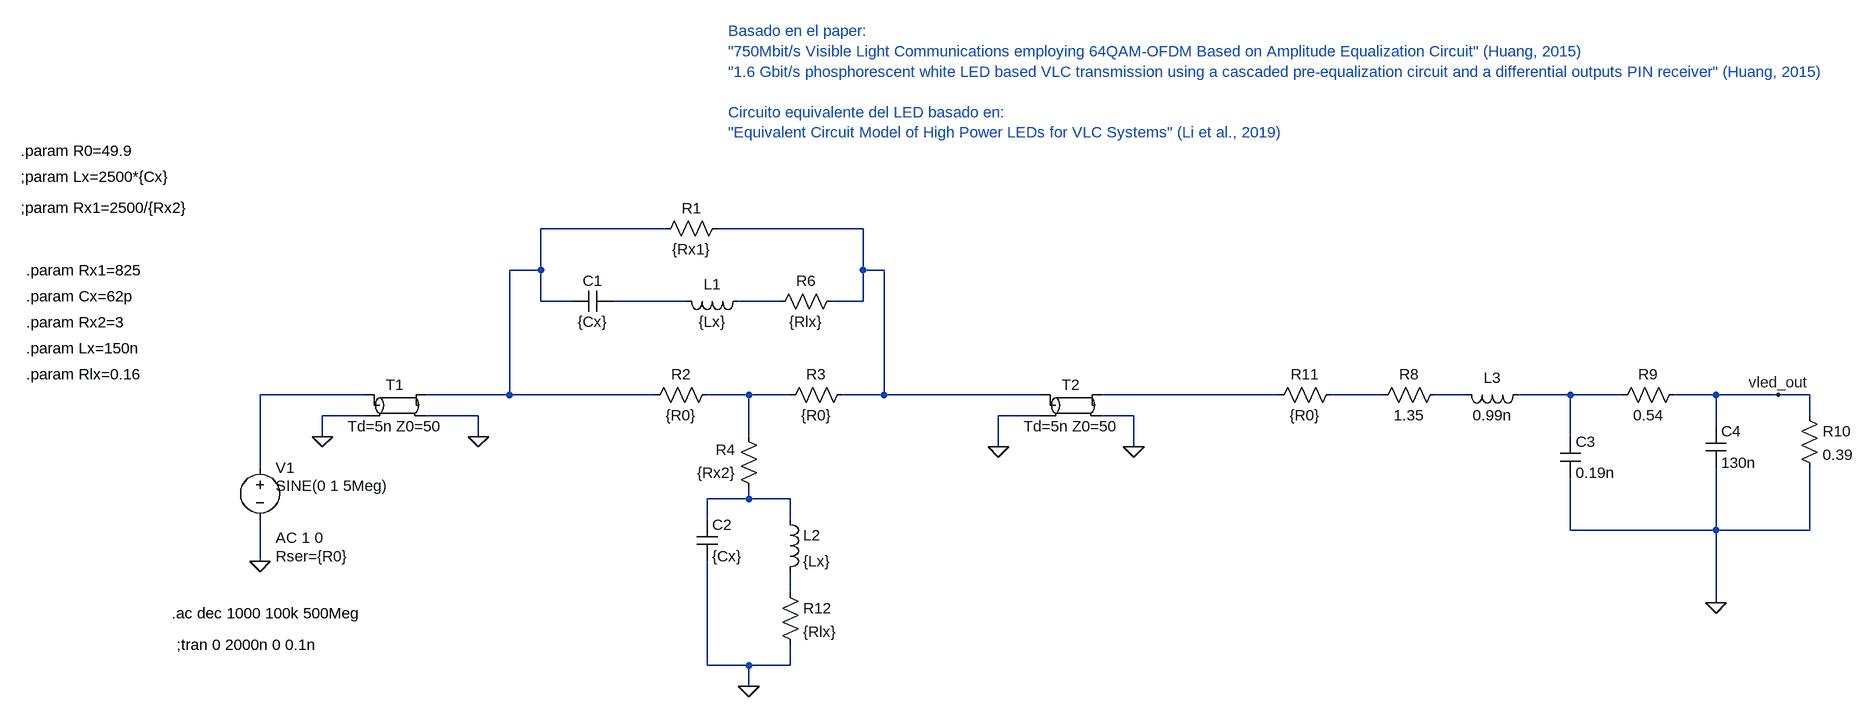
[diagram p0: schematic filtro_t.asc]
filtro_t.asc, the LTspice schematic file:
Version 4
SHEET 1 3516 848
WIRE -32 64 -224 64
WIRE 272 64 48 64
WIRE -224 128 -224 64
WIRE -224 128 -272 128
WIRE 272 128 272 64
WIRE 304 128 272 128
WIRE -224 176 -224 128
WIRE -176 176 -224 176
WIRE 0 176 -112 176
WIRE 144 176 80 176
WIRE 272 176 272 128
WIRE 272 176 224 176
WIRE -496 320 -656 320
WIRE -272 320 -272 128
WIRE -272 320 -400 320
WIRE -48 320 -272 320
WIRE 96 320 32 320
WIRE 160 320 96 320
WIRE 304 320 304 128
WIRE 304 320 240 320
WIRE 544 320 304 320
WIRE 912 320 640 320
WIRE 1072 320 992 320
WIRE 1200 320 1152 320
WIRE 1360 320 1280 320
WIRE 1440 320 1360 320
WIRE 1584 320 1520 320
WIRE 1680 320 1584 320
WIRE 1728 320 1680 320
WIRE -496 352 -560 352
WIRE -320 352 -400 352
WIRE 544 352 480 352
WIRE 688 352 640 352
WIRE 1728 352 1728 320
WIRE 1584 368 1584 320
WIRE -560 384 -560 352
WIRE -320 384 -320 352
WIRE 96 384 96 320
WIRE 1360 384 1360 320
WIRE 480 400 480 352
WIRE 688 400 688 352
WIRE -656 432 -656 320
WIRE 96 480 96 464
WIRE 96 480 32 480
WIRE 160 480 96 480
WIRE 32 512 32 480
WIRE 160 512 160 480
WIRE 1360 528 1360 448
WIRE 1584 528 1584 432
WIRE 1584 528 1360 528
WIRE 1728 528 1728 432
WIRE 1728 528 1584 528
WIRE -656 576 -656 512
WIRE 160 624 160 592
WIRE 1584 640 1584 528
WIRE 32 736 32 576
WIRE 96 736 32 736
WIRE 160 736 160 704
WIRE 160 736 96 736
WIRE 96 768 96 736
FLAG -656 576 0
FLAG -320 384 0
FLAG -560 384 0
FLAG 688 400 0
FLAG 480 400 0
FLAG 1584 640 0
FLAG 1680 320 vled_out
FLAG 96 768 0
SYMBOL res 64 48 R90
WINDOW 0 0 56 VBottom 2
WINDOW 3 32 56 VTop 2
SYMATTR InstName R1
SYMATTR Value {Rx1}
SYMBOL cap -112 160 R90
WINDOW 0 0 32 VBottom 2
WINDOW 3 32 32 VTop 2
SYMATTR InstName C1
SYMATTR Value {Cx}
SYMBOL ind 96 160 R90
WINDOW 0 5 56 VBottom 2
WINDOW 3 32 56 VTop 2
SYMATTR InstName L1
SYMATTR Value {Lx}
SYMBOL res 48 304 R90
WINDOW 0 0 56 VBottom 2
WINDOW 3 32 56 VTop 2
SYMATTR InstName R2
SYMATTR Value {R0}
SYMBOL res 256 304 R90
WINDOW 0 0 56 VBottom 2
WINDOW 3 32 56 VTop 2
SYMATTR InstName R3
SYMATTR Value {R0}
SYMBOL res 112 480 R180
WINDOW 0 36 76 Left 2
WINDOW 3 36 40 Left 2
SYMATTR InstName R4
SYMATTR Value {Rx2}
SYMBOL cap 16 512 R0
SYMATTR InstName C2
SYMATTR Value {Cx}
SYMBOL ind 144 496 R0
SYMATTR InstName L2
SYMATTR Value {Lx}
SYMBOL voltage -656 416 R0
WINDOW 123 24 124 Left 2
WINDOW 39 24 152 Left 2
WINDOW 3 24 44 Left 2
SYMATTR Value2 AC 1 0
SYMATTR SpiceLine Rser={R0}
SYMATTR Value SINE(0 1 5Meg)
SYMATTR InstName V1
SYMBOL tline -448 336 R0
SYMATTR InstName T1
SYMATTR Value Td=5n Z0=50
SYMBOL tline 592 336 R0
SYMATTR InstName T2
SYMATTR Value Td=5n Z0=50
SYMBOL res 1168 304 R90
WINDOW 0 0 56 VBottom 2
WINDOW 3 32 56 VTop 2
SYMATTR InstName R8
SYMATTR Value 1.35
SYMBOL cap 1344 384 R0
SYMATTR InstName C3
SYMATTR Value 0.19n
SYMBOL ind 1296 304 R90
WINDOW 0 5 56 VBottom 2
WINDOW 3 32 56 VTop 2
SYMATTR InstName L3
SYMATTR Value 0.99n
SYMBOL res 1536 304 R90
WINDOW 0 0 56 VBottom 2
WINDOW 3 32 56 VTop 2
SYMATTR InstName R9
SYMATTR Value 0.54
SYMBOL cap 1568 368 R0
SYMATTR InstName C4
SYMATTR Value 130n
SYMBOL res 1712 336 R0
SYMATTR InstName R10
SYMATTR Value 0.39
SYMBOL res 1008 304 R90
WINDOW 0 0 56 VBottom 2
WINDOW 3 32 56 VTop 2
SYMATTR InstName R11
SYMATTR Value {R0}
SYMBOL res 144 608 R0
SYMATTR InstName R12
SYMATTR Value {Rlx}
SYMBOL res 240 160 R90
WINDOW 0 0 56 VBottom 2
WINDOW 3 32 56 VTop 2
SYMATTR InstName R6
SYMATTR Value {Rlx}
TEXT -1024 -16 Left 2 !;param Lx=2500*{Cx}
TEXT -1024 -56 Left 2 !.param R0=49.9
TEXT -792 656 Left 2 !.ac dec 1000 100k 500Meg
TEXT -1024 32 Left 2 !;param Rx1=2500/{Rx2}
TEXT -1016 168 Left 2 !.param Cx=62p
TEXT -1016 208 Left 2 !.param Rx2=3
TEXT -784 704 Left 2 !;tran 0 2000n 0 0.1n
TEXT -1016 128 Left 2 !.param Rx1=825
TEXT -1016 248 Left 2 !.param Lx=150n
TEXT -1016 288 Left 2 !.param Rlx=0.16
TEXT 64 -240 Left 2 ;Basado en el paper:\n"750Mbit/s Visible Light Communications employing 64QAM-OFDM Based on Amplitude Equalization Circuit" (Huang, 2015)\n"1.6 Gbit/s phosphorescent white LED based VLC transmission using a cascaded pre-equalization circuit and a differential outputs PIN receiver" (Huang, 2015)\n \nCircuito equivalente del LED basado en:\n"Equivalent Circuit Model of High Power LEDs for VLC Systems" (Li et al., 2019)

The netlist it stands for:
* filtro_t.asc
R1 N002 N001 {Rx1}
C1 N003 N001 {Cx}
L1 N004 N003 {Lx}
R2 N006 N001 {R0}
R3 N002 N006 {R0}
R4 N011 N006 {Rx2}
C2 N011 0 {Cx}
L2 N011 N012 {Lx}
V1 N005 0 SINE(0 1 5Meg) AC 1 0 Rser={R0}
T1 N005 0 N001 0 Td=5n Z0=50
T2 N002 0 N007 0 Td=5n Z0=50
R8 N009 N008 1.35
C3 N010 0 0.19n
L3 N010 N009 0.99n
R9 vled_out N010 0.54
C4 vled_out 0 130n
R10 vled_out 0 0.39
R11 N008 N007 {R0}
R12 N012 0 {Rlx}
R6 N002 N004 {Rlx}
;param Lx=2500*{Cx}
.param R0=49.9
.ac dec 1000 100k 500Meg
;param Rx1=2500/{Rx2}
.param Cx=62p
.param Rx2=3
;tran 0 2000n 0 0.1n
.param Rx1=825
.param Lx=150n
.param Rlx=0.16
* Basado en el paper:
* "750Mbit/s Visible Light Communications employing 64QAM-OFDM Based on Amplitude Equalization Circuit" (Huang, 2015)
* "1.6 Gbit/s phosphorescent white LED based VLC transmission using a cascaded pre-equalization circuit and a differential outputs PIN receiver" (Huang, 2015)
* Circuito equivalente del LED basado en:
* "Equivalent Circuit Model of High Power LEDs for VLC Systems" (Li et al., 2019)
.backanno
.end